# Altium project MAGI'sUART.PrjPcb
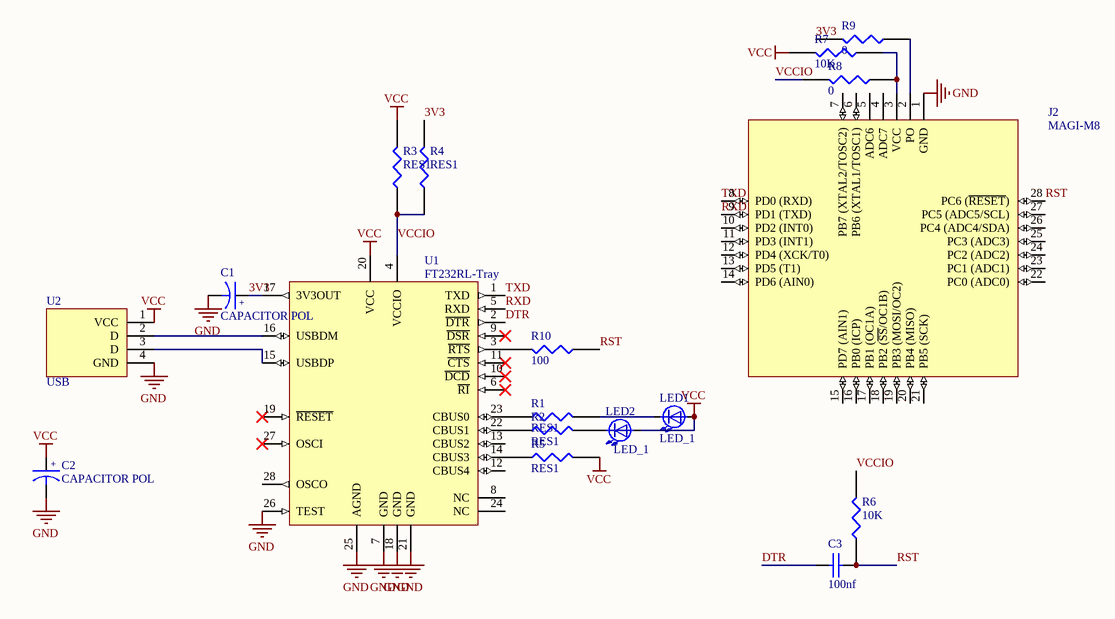
[diagram p0: MAGI'sUART.SchDoc]
1 sheet, 18 parts. Net scope: global (net labels, ports and power ports of the same name join across sheets).
Board file: MAGI'sUART.PcbDoc

## Sheet MAGI'sUART.SchDoc
size A4

### Parts
C1  CAPACITOR POL  [6-0805_N]
C2  CAPACITOR POL  [6-0805_N]
C3  100nf  [6-0805_n]
J2  MAGI-M8  [MAGI-M8]
LED1  LED_1  [6-0805_N]
LED2  LED_1  [6-0805_N]
R1  RES1  [6-0805_n]
R2  RES1  [6-0805_n]
R3  RES1  [6-0805_N]
R4  RES1  [6-0805_N]
R5  RES1  [6-0805_N]
R6  10K  [6-0805_N]
R7  10K  [6-0805_N]
R8  0  [6-0805_N]
R9  0  [6-0805_N]
R10  100  [6-0805_N]
U1  FT232RL-Tray  [SSOP-28_N]
U2  USB  [MicroUSB]

### Nets
GND: C1.2 C2.2 J2.1(GND) U1.7(GND) U1.18(GND) U1.21(GND) U1.25(AGND) U1.26(TEST) U2.4(GND)
VCC: C2.1 LED1.1(A) LED2.1(A) R3.2 R5.2 R7.2 U1.20(VCC) U2.1(VCC)
3V3: C1.1 R4.2 R9.2 U1.17(3V3OUT)
DTR: C3.1 U1.2(~{DTR})
RST: C3.2 J2.28(PC6_(~{RESET})) R6.1 R10.1
RXD: J2.9(PD1_(TXD)) U1.5(RXD)
TXD: J2.8(PD0_(RXD)) U1.1(TXD)
VCCIO: R3.1 R4.1 R6.2 R8.2 U1.4(VCCIO)
NetJ2_2: J2.2(PO) R9.1
NetJ2_3: J2.3(VCC) R7.1 R8.1
NetLED1_2: LED1.2(K) R1.2
NetLED2_2: LED2.2(K) R2.2
NetR1_1: R1.1 U1.23(CBUS0)
NetR2_1: R2.1 U1.22(CBUS1)
NetR5_1: R5.1 U1.14(CBUS3)
NetR10_2: R10.2 U1.3(~{RTS})
NetU1_15: U1.15(USBDP) U2.3(D)
NetU1_16: U1.16(USBDM) U2.2(D)

Not connected (* = marked no-connect by the designer): J2 4(ADC7) 5(ADC6) 6(PB6_(XTAL1/TOSC1)) 7(PB7_(XTAL2/TOSC2)) 10(PD2_(INT0)) 11(PD3_(INT1)) 12(PD4_(XCK/T0)) 13(PD5_(T1)) 14(PD6_(AIN0)) 15(PD7_(AIN1)) 16(PB0_(ICP)) 17(PB1_(OC1A)) 18(PB2_(~{SS}/OC1B)) 19(PB3_(MOSI/OC2)) 20(PB4_(MISO)) 21(PB5_(SCK)) 22(PC0_(ADC0)) 23(PC1_(ADC1)) 24(PC2_(ADC2)) 25(PC3_(ADC3)) 26(PC4_(ADC4/SDA)) 27(PC5_(ADC5/SCL)); U1 6(~{RI})* 8(NC) 9(~{DSR})* 10(~{DCD})* 11(~{CTS})* 12(CBUS4) 13(CBUS2) 19(~{RESET})* 24(NC) 27(OSCI)* 28(OSCO)

### Notes on the sheet
- (in symbol CAPACITOR POL) +

### Library data of the parts
C1 C2 = CAPACITOR POL: Capacitor
C3 = CAP_1: Capacitor
R6-R10 = RES1
U1 = FT232RL-Tray: USB UART Asynchronous Serial Data Transfer Chip, SSOP-28, Tray; Published: 19-Aug-2010; DatasheetVersion: ver 2.07, Jul-2010; PackageVersion: 2010; PackageReference: SSOP-28; Publisher: Altium Limited; PackageDescription: 28-Pin Small Outline Package 0.65 mm Pitch; ComponentLink1Description: Manufacturer Link; ComponentLink1URL: http://www.ftdichip.com/Products/ICs/FT232R.htm; ComponentLink2Description: Datasheet; ComponentLink2URL: http://www.ftdichip.com/Support/Documents/DataSheets/ICs/DS_FT232R.pdf